# EAGLE schematic PackageCheck (EAGLE 8.2.2)
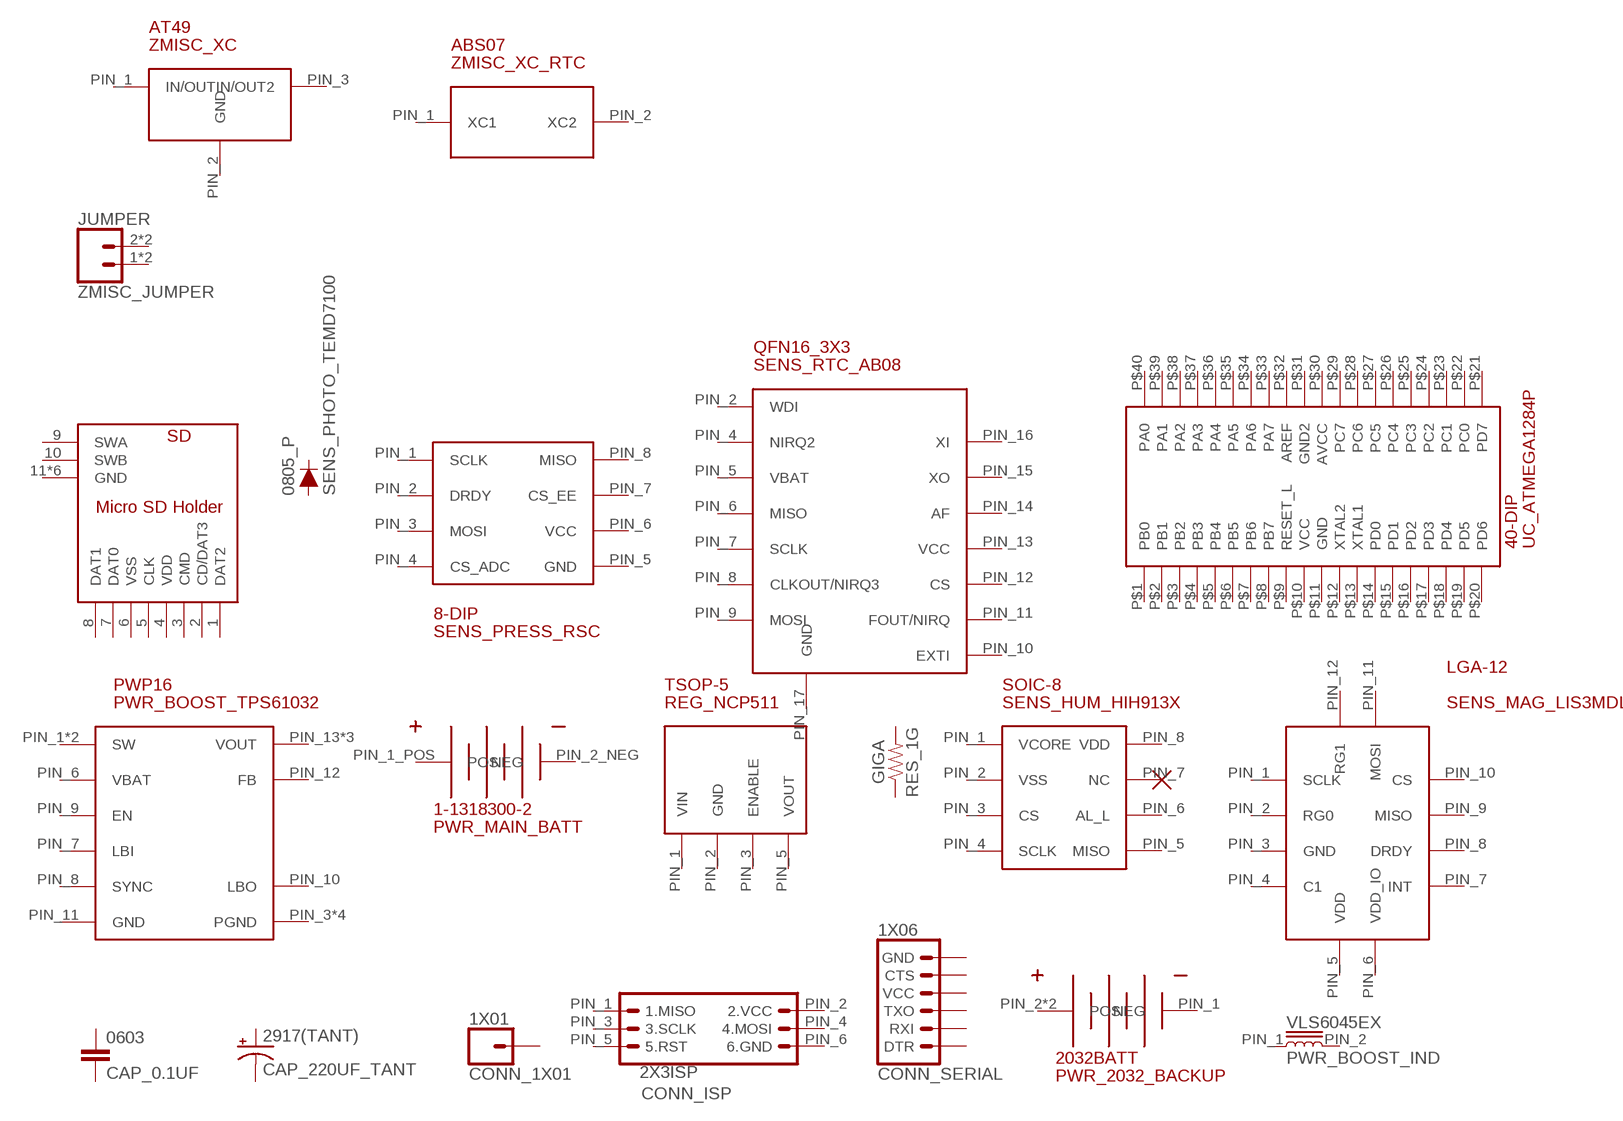
[diagram p0: schematic, sheet 1]

## Parts
1-1318300-2  PWR_MAIN_BATT  [1-1318300-2]
1X01  CONN_1X01  [1X01]
1X06  CONN_SERIAL  [1X06]
2X3ISP  CONN_ISP  [2X3]
8-DIP  SENS_PRESS_RSC  [8-DIP]
40-DIP  UC_ATMEGA1284P  [40-DIP]
0603  CAP_0.1UF  [SMD_0603]
0805_P  SENS_PHOTO_TEMD7100  [SMD_0805_P]
2032BATT  PWR_2032_BACKUP  [2032_HOLDER]
2917(TANT)  CAP_220UF_TANT  [SMD_2917_P]
ABS07  ZMISC_XC_RTC  [ABS07]
AT49  ZMISC_XC  [AT49]
GIGA  RES_1G  [GIGA]
JUMPER  ZMISC_JUMPER  [1X02]
LGA-12  SENS_MAG_LIS3MDL  [LGA-12]
PWP16  PWR_BOOST_TPS61032  [PWP-16]
QFN16_3X3  SENS_RTC_AB08  [QFN16_3X3]
SD  SENS_MICRO-SD  [MICRO-SD]
SOIC-8  SENS_HUM_HIH913X  [SOIC-8]
TSOP-5  REG_NCP511  [TSOP-5]
VLS6045EX  PWR_BOOST_IND  [VLS6045EX]
Unconnected: 1-1318300-2.PIN_1_POS(POS) 1-1318300-2.PIN_2_NEG(NEG) 1X01.1 1X06.1(DTR) 1X06.2(RXI) 1X06.3(TXO) 1X06.4(VCC) 1X06.5(CTS) 1X06.6(GND) 2X3ISP.PIN_1(1.MISO) 2X3ISP.PIN_2(2.VCC) 2X3ISP.PIN_3(3.SCLK) 2X3ISP.PIN_4(4.MOSI) 2X3ISP.PIN_5(5.RST) 2X3ISP.PIN_6(6.GND) 8-DIP.PIN_1(SCLK) 8-DIP.PIN_2(DRDY) 8-DIP.PIN_3(MOSI) 8-DIP.PIN_4(CS_ADC) 8-DIP.PIN_5(GND) 8-DIP.PIN_6(VCC) 8-DIP.PIN_7(CS_EE) 8-DIP.PIN_8(MISO) 40-DIP.P$1(PB0) 40-DIP.P$2(PB1) 40-DIP.P$3(PB2) 40-DIP.P$4(PB3) 40-DIP.P$5(PB4) 40-DIP.P$6(PB5) 40-DIP.P$7(PB6) 40-DIP.P$8(PB7) 40-DIP.P$9(RESET_L) 40-DIP.P$10(VCC) 40-DIP.P$11(GND) 40-DIP.P$12(XTAL2) 40-DIP.P$13(XTAL1) 40-DIP.P$14(PD0) 40-DIP.P$15(PD1) 40-DIP.P$16(PD2) 40-DIP.P$17(PD3) 40-DIP.P$18(PD4) 40-DIP.P$19(PD5) 40-DIP.P$20(PD6) 40-DIP.P$21(PD7) 40-DIP.P$22(PC0) 40-DIP.P$23(PC1) 40-DIP.P$24(PC2) 40-DIP.P$25(PC3) 40-DIP.P$26(PC4) 40-DIP.P$27(PC5) 40-DIP.P$28(PC6) 40-DIP.P$29(PC7) 40-DIP.P$30(AVCC) 40-DIP.P$31(GND2) 40-DIP.P$32(AREF) 40-DIP.P$33(PA7) 40-DIP.P$34(PA6) 40-DIP.P$35(PA5) 40-DIP.P$36(PA4) 40-DIP.P$37(PA3) 40-DIP.P$38(PA2) 40-DIP.P$39(PA1) 40-DIP.P$40(PA0) 0603.P$1 0603.P$2 0805_P.PIN_1(C) 0805_P.PIN_2(A) 2032BATT.PIN_1(NEG) 2032BATT.PIN_2(POS) 2032BATT.PIN_3(POS) 2917(TANT).PIN_1_-(-) 2917(TANT).PIN_2_+(+) ABS07.PIN_1(XC1) ABS07.PIN_2(XC2) AT49.PIN_1(IN/OUT) AT49.PIN_2(GND) AT49.PIN_3(IN/OUT2) GIGA.P$1 GIGA.P$2 JUMPER.1 JUMPER.2 JUMPER.P$1 JUMPER.P$2 LGA-12.PIN_1(SCLK) LGA-12.PIN_2(RG0) LGA-12.PIN_3(GND) LGA-12.PIN_4(C1) LGA-12.PIN_5(VDD) LGA-12.PIN_6(VDD_IO) LGA-12.PIN_7(INT) LGA-12.PIN_8(DRDY) LGA-12.PIN_9(MISO) LGA-12.PIN_10(CS) LGA-12.PIN_11(MOSI) LGA-12.PIN_12(RG1) PWP16.PIN_1(SW) PWP16.PIN_2(SW) PWP16.PIN_3(PGND) PWP16.PIN_4(PGND) PWP16.PIN_5(PGND) PWP16.PIN_6(VBAT) PWP16.PIN_7(LBI) PWP16.PIN_8(SYNC) PWP16.PIN_9(EN) PWP16.PIN_10(LBO) PWP16.PIN_11(GND) PWP16.PIN_12(FB) PWP16.PIN_13(VOUT) PWP16.PIN_14(VOUT) PWP16.PIN_15(VOUT) PWP16.PIN_17(PGND) QFN16_3X3.PIN_2(WDI) QFN16_3X3.PIN_4(NIRQ2) QFN16_3X3.PIN_5(VBAT) QFN16_3X3.PIN_6(MISO) QFN16_3X3.PIN_7(SCLK) QFN16_3X3.PIN_8(CLKOUT/NIRQ3) QFN16_3X3.PIN_9(MOSI) QFN16_3X3.PIN_10(EXTI) QFN16_3X3.PIN_11(FOUT/NIRQ) QFN16_3X3.PIN_12(CS) QFN16_3X3.PIN_13(VCC) QFN16_3X3.PIN_14(AF) QFN16_3X3.PIN_15(XO) QFN16_3X3.PIN_16(XI) QFN16_3X3.PIN_17(GND) SD.1(DAT2) SD.2(CD/DAT3) SD.3(CMD) SD.4(VDD) SD.5(CLK) SD.6(VSS) SD.7(DAT0) SD.8(DAT1) SD.9(SWA) SD.10(SWB) SD.11(GND) SD.12(GND) SD.13(GND) SD.14(GND) SD.15(GND) SD.16(GND) SOIC-8.PIN_1(VCORE) SOIC-8.PIN_2(VSS) SOIC-8.PIN_3(CS) SOIC-8.PIN_4(SCLK) SOIC-8.PIN_5(MISO) SOIC-8.PIN_6(AL_L) SOIC-8.PIN_7(NC) SOIC-8.PIN_8(VDD) TSOP-5.PIN_1(VIN) TSOP-5.PIN_2(GND) TSOP-5.PIN_3(ENABLE) TSOP-5.PIN_5(VOUT) VLS6045EX.PIN_1 VLS6045EX.PIN_2

## Library data of the parts
1-1318300-2 = SNWCT_EAGLE_LBR:PWR_MAIN_BATT
1X01 = SNWCT_EAGLE_LBR:CONN_1X01
1X06 = SNWCT_EAGLE_LBR:CONN_SERIAL
2X3ISP = SNWCT_EAGLE_LBR:CONN_ISP
8-DIP = SNWCT_EAGLE_LBR:SENS_PRESS_RSC
40-DIP = SNWCT_EAGLE_LBR:UC_ATMEGA1284P
0603 = SNWCT_EAGLE_LBR:CAP_0.1UF
0805_P = SNWCT_EAGLE_LBR:SENS_PHOTO_TEMD7100
2032BATT = SNWCT_EAGLE_LBR:PWR_2032_BACKUP
2917(TANT) = SNWCT_EAGLE_LBR:CAP_220UF_TANT
ABS07 = SNWCT_EAGLE_LBR:ZMISC_XC_RTC
AT49 = SNWCT_EAGLE_LBR:ZMISC_XC
GIGA = SNWCT_EAGLE_LBR:RES_1G
JUMPER = SNWCT_EAGLE_LBR:ZMISC_JUMPER
LGA-12 = SNWCT_EAGLE_LBR:SENS_MAG_LIS3MDL
PWP16 = SNWCT_EAGLE_LBR:PWR_BOOST_TPS61032
QFN16_3X3 = SNWCT_EAGLE_LBR:SENS_RTC_AB08
SD = SNWCT_EAGLE_LBR:SENS_MICRO-SD
SOIC-8 = SNWCT_EAGLE_LBR:SENS_HUM_HIH913X: SPI Humidity sensor Digikey:480-5707-6-ND
TSOP-5 = SNWCT_EAGLE_LBR:REG_NCP511
VLS6045EX = SNWCT_EAGLE_LBR:PWR_BOOST_IND